# EAGLE design Moodlamp (EAGLE 7.2.0)
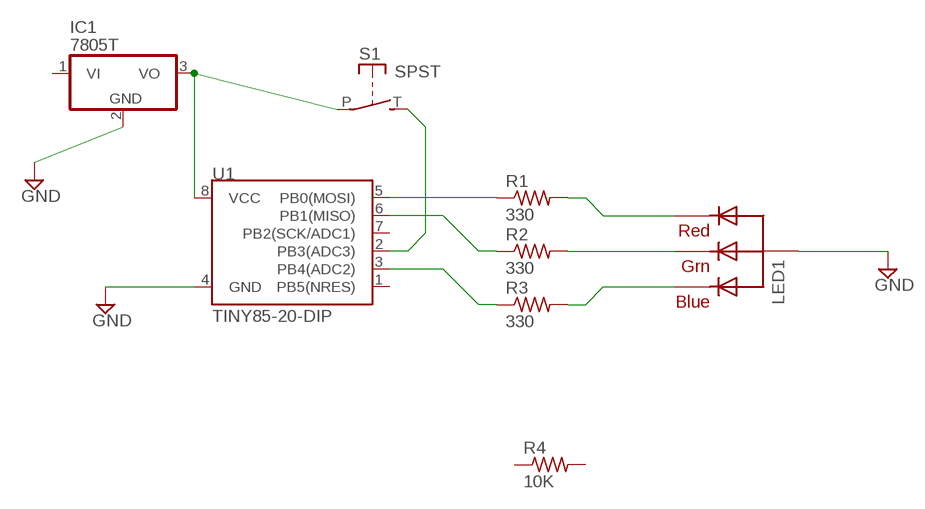
[diagram p0: schematic, sheet 1]

## Parts
IC1  7805T  [TO220H]
LED1  RGBLED_CA-5MM  [LED5MMRGB]
R1  330  R-US_0207/10  [0207/10]
R2  330  R-US_0207/10  [0207/10]
R3  330  R-US_0207/10  [0207/10]
R4  10K  R-US_0207/10  [0207/10]
S1  SPST  [JUDCOSPST]
U1  TINY85-20-DIP  ATTINY45TINY85-20-DIP  [DIP08]

## Nets
GND: IC1.2(GND) LED1.2(VCC) U1.4(GND)
N$1: LED1.1(RED) R1.2
N$2: LED1.3(GREEN) R2.2
N$3: LED1.4(BLUE) R3.2
N$4: R1.1 U1.5(PB0(MOSI))
N$5: R2.1 U1.6(PB1(MISO))
N$6: R3.1 U1.3(PB4(ADC2))
N$7: IC1.3(VO) S1.P U1.8(VCC)
N$8: S1.T(S) U1.2(PB3(ADC3))
Unconnected: IC1.1(VI) R4.1 R4.2 U1.1(PB5(NRES)) U1.7(PB2(SCK/ADC1))

## Library data of the parts
IC1 = linear:78*: Positive VOLTAGE REGULATOR Source: http://cache.national.com/ds/LM/LM78L05.pdf http://www.fairchildsemi.com/ds/LM/LM7805.pdf
LED1 = adafruit:RGBLED_CA: RGB LED, common-anode 5MM Staggered pins 5mm Piranha package http://www.ladyada.net/library/pcb/eaglelibrary.html
R1-R4 = resistor:R-US_: RESISTOR, American symbol
S1 = adafruit:SPST: Judco 50-0015-00
U1 = SparkFun-DigitalIC:ATTINY45: Atmel 8-pin 2/4/8kB flash uC; PROD_ID: IC-09445

## Board
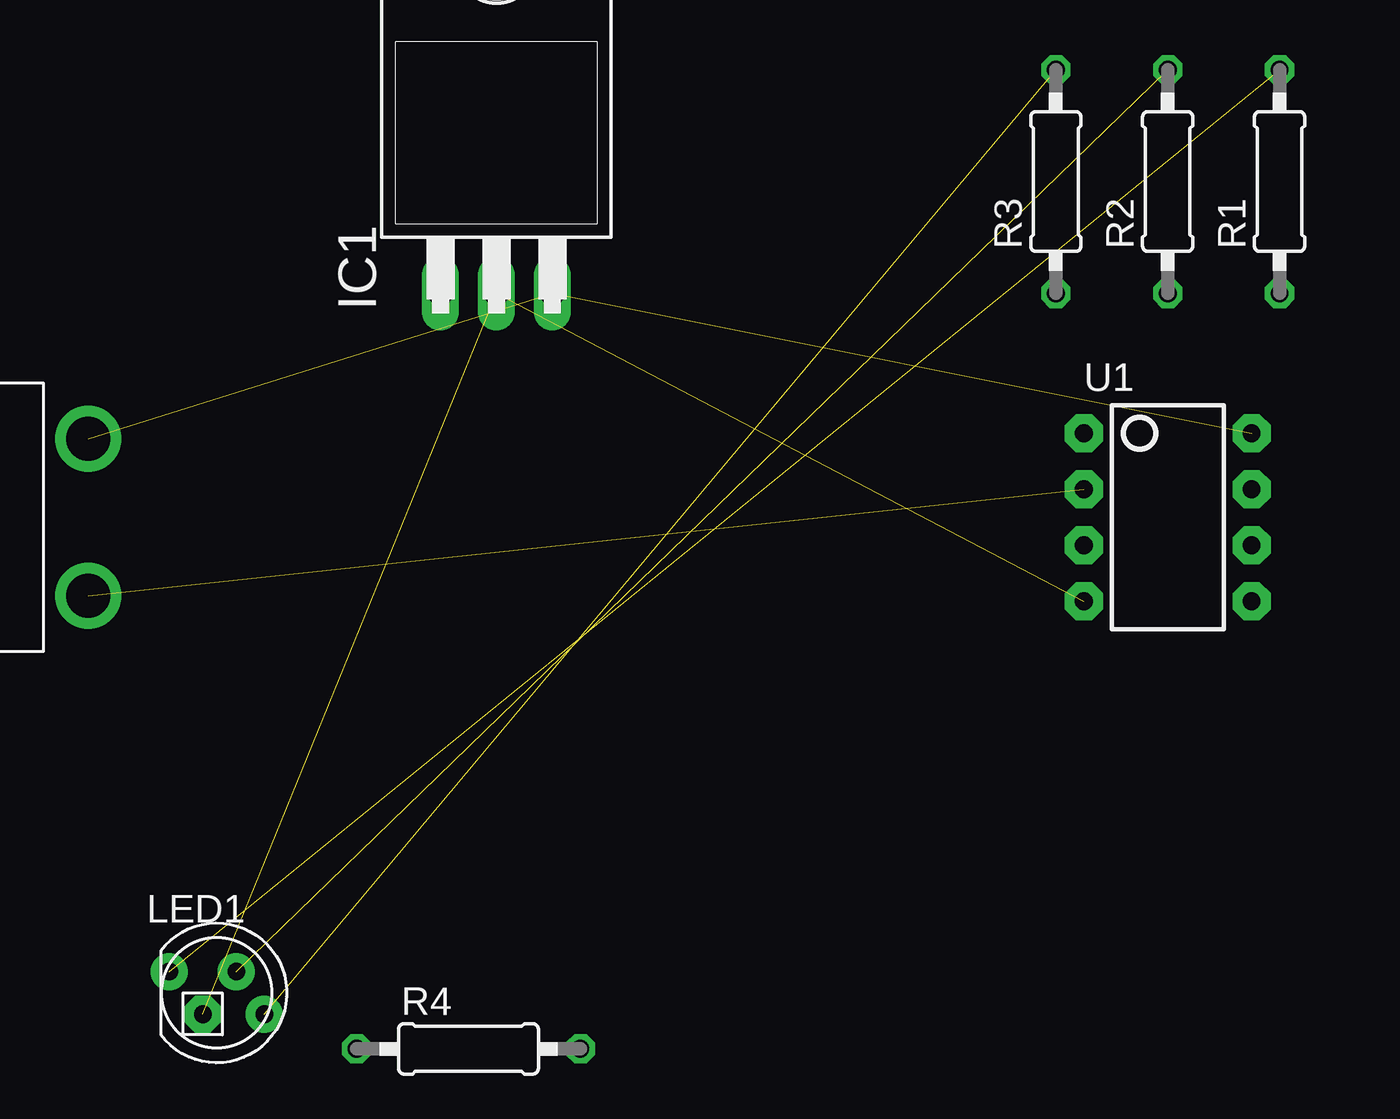
[diagram p1: board, top side]
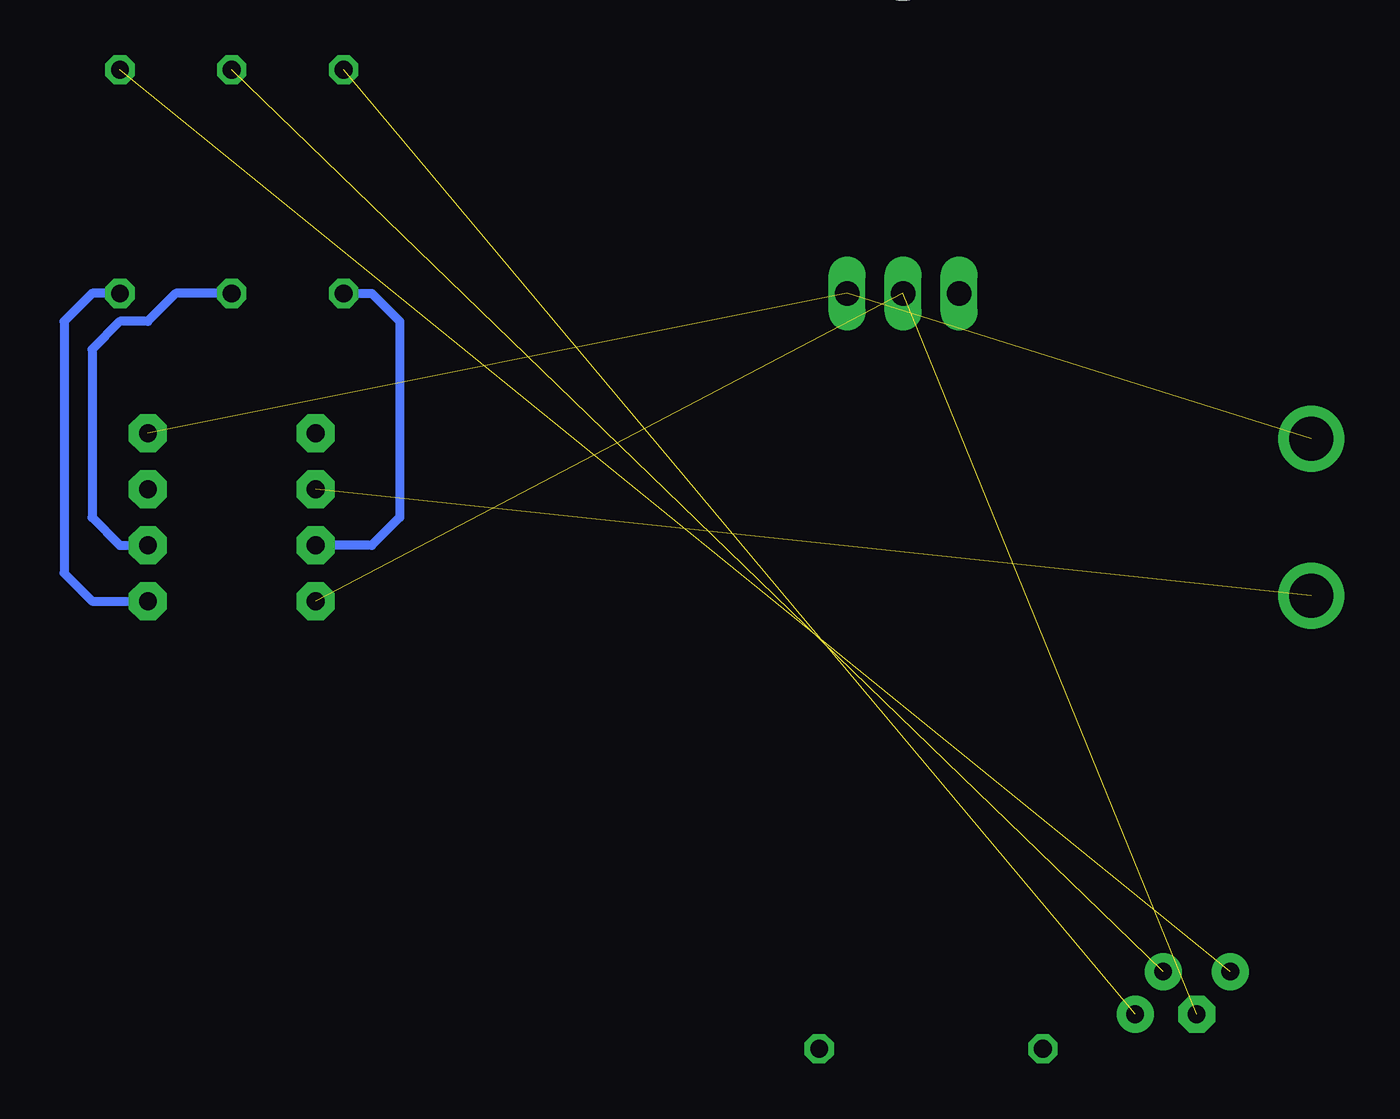
[diagram p2: board, bottom side, seen from below]

No outline drawn. Coordinates in mm, seen from the top.
Copper layers (1*16): Top 0.035mm / dielectric 1.5mm / Bottom 0.035mm
Design rules "default": minimum track width 10mil, minimum drill 24mil, track to track 8mil, track to pad 8mil, pad to pad 8mil, via to via 8mil, smd to smd 8mil, copper to edge 40mil, drill to drill 8mil, minimum pad ring 10mil, minimum via ring 8mil, stop-mask expansion 4mil, vias tented up to drill 0mil, thermal gap 10mil

### Footprints (pad centres in the part's own frame; a part is rotated, then mirrored left to right if it is on the bottom)
TO220H = drill 1.118 long: 1 -2.54,-10.16; 2 0,-10.16; 3 2.54,-10.16 | hole 3.302: 0,4.826
LED5MMRGB = drill 0.8 pad 1.676: 1 -2.159,0.968; 3 0.889,0.968; 4 2.159,-0.968 | drill 0.8 pad 1.676 octagon: 2 -0.635,-0.968
0207/10 = drill 0.813 octagon: 1 -5.08,0; 2 5.08,0
JUDCOSPST = drill 2: P 3.556,-8.128; T -3.556,-8.128
DIP08 = drill 0.813 pad 1.727 octagon: 1 -3.81,-3.81; 2 -1.27,-3.81; 3 1.27,-3.81; 4 3.81,-3.81; 5 3.81,3.81; 6 1.27,3.81; 7 -1.27,3.81; 8 -3.81,3.81

### Placement (x,y rotation side)
IC1  38.1,45.72 0 top
LED1  25.4,3.81 0 top
R1  73.66,40.64 90 top
R2  68.58,40.64 90 top
R3  63.5,40.64 90 top
R4  36.83,1.27 0 top
S1  11.43,25.4 90 top
U1  68.58,25.4 270 top

### Tracks (layer width: path | path; a pad name or v marks a point on that pad's centre or on a via)
GND  (2 unrouted)
N$1  (1 unrouted)
N$2  (1 unrouted)
N$3  (1 unrouted)
N$4
  Bottom 0.406: R1.1 74.93,35.56 76.2,34.29 76.2,22.86 74.93,21.59 U1.5
N$5
  Bottom 0.406: R2.1 71.12,35.56 72.39,34.29 73.66,34.29 74.93,33.02 74.93,25.4 73.66,24.13 U1.6
N$6
  Bottom 0.406: R3.1 62.23,35.56 60.96,34.29 60.96,25.4 62.23,24.13 U1.3
N$7  (2 unrouted)
N$8  (1 unrouted)